# Altium schematic sheet 40-DIGITAL.SchDoc
size 594 x 420 mm
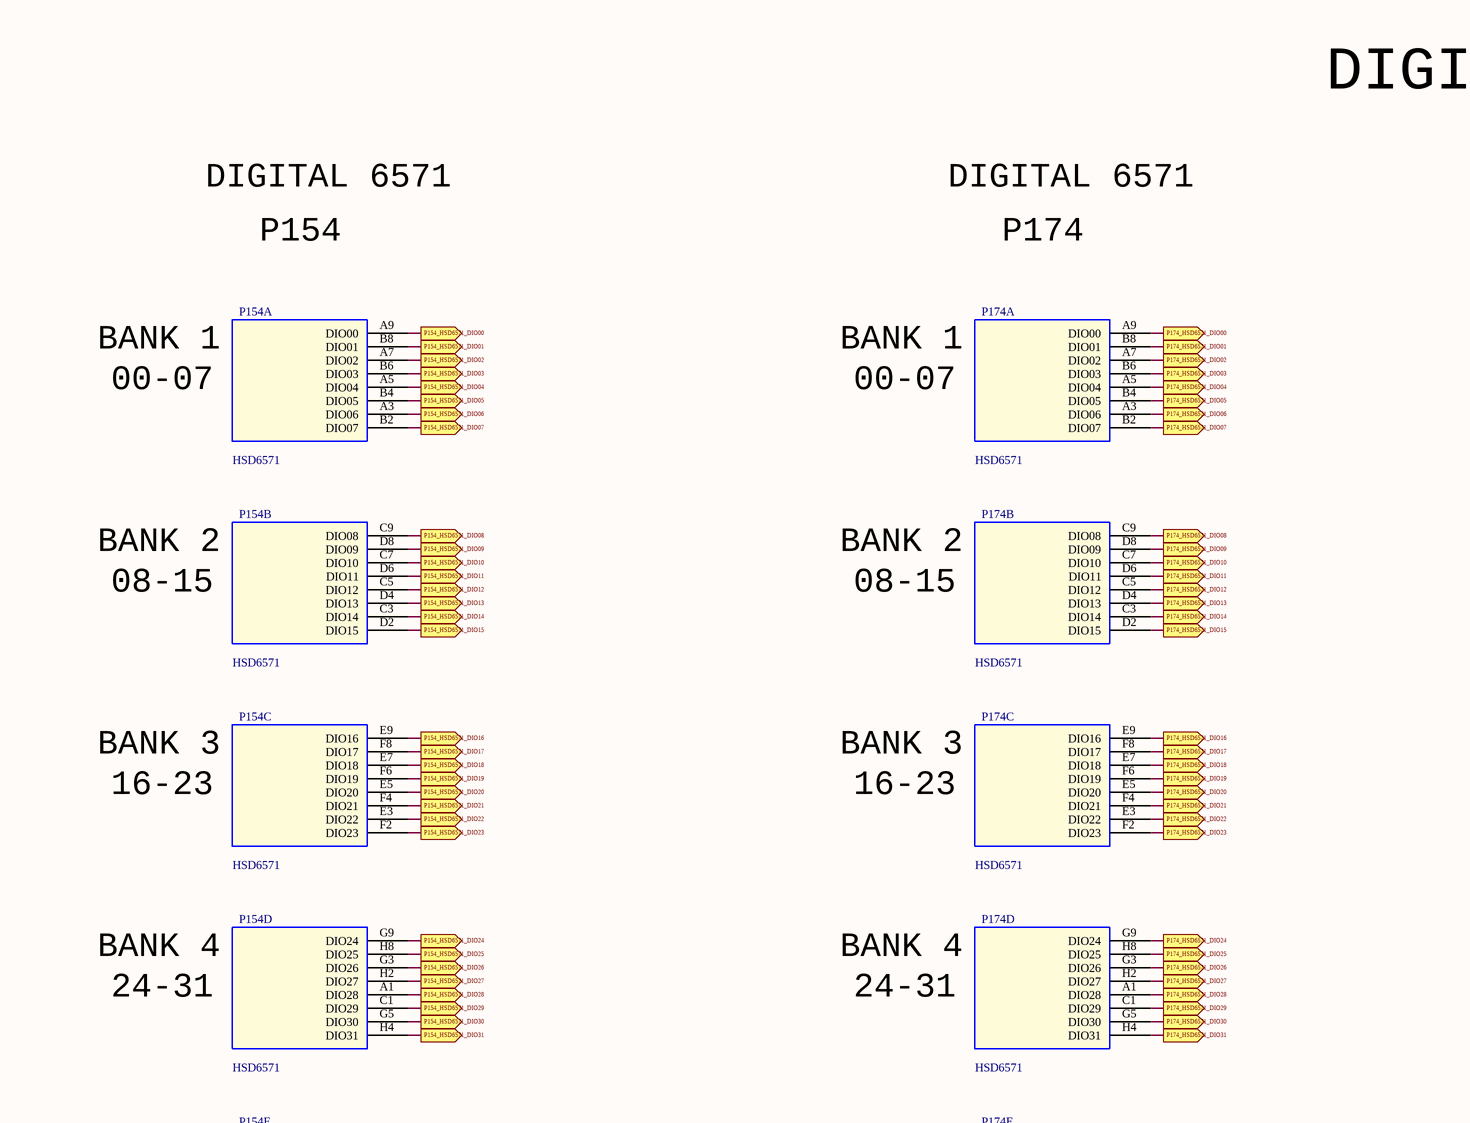
[diagram p0: 40-DIGITAL.SchDoc, top left]
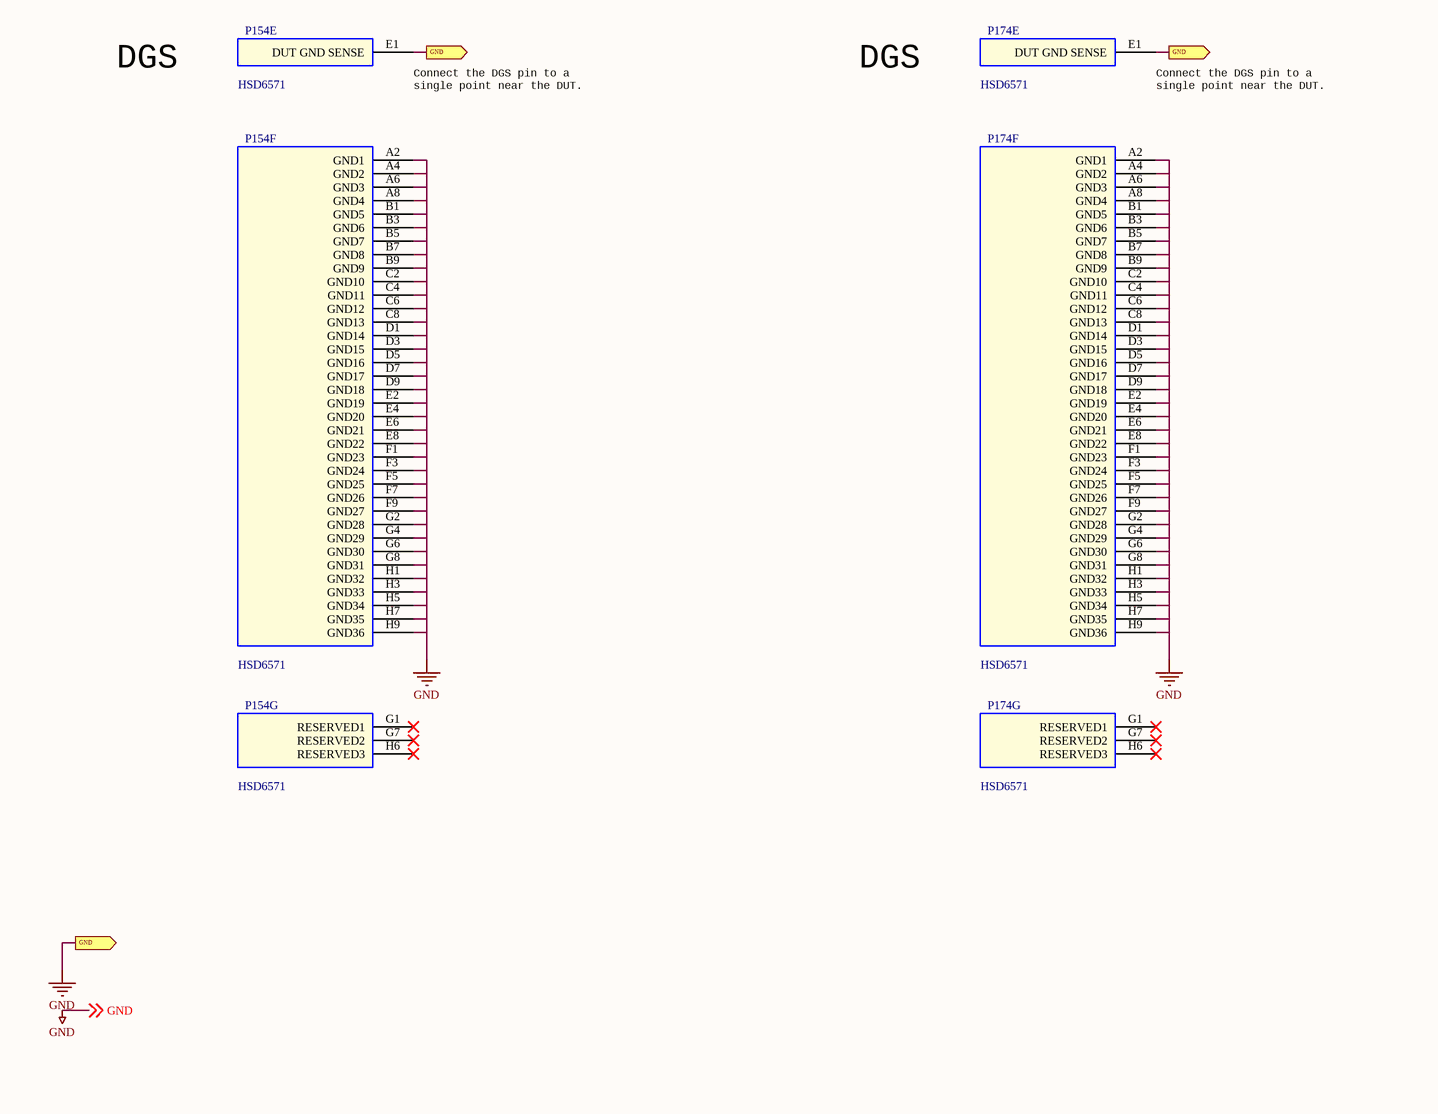
[diagram p1: 40-DIGITAL.SchDoc, bottom left]
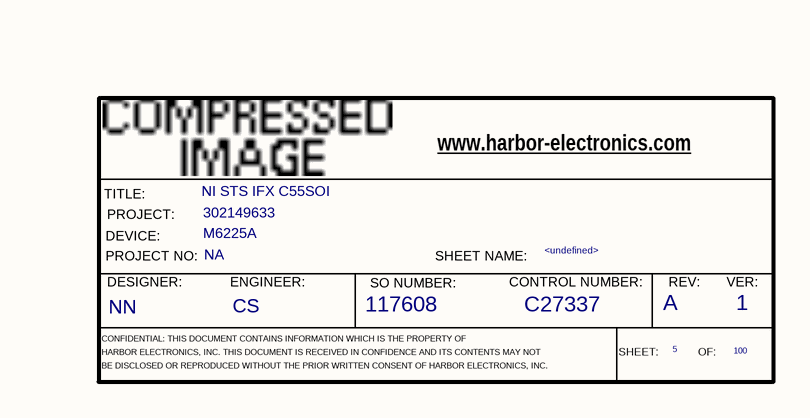
[diagram p2: 40-DIGITAL.SchDoc, bottom right]

## Parts
*  RevCode: A  Title: NI STS IFX C55SOI  Page Number: 5  Page Count: 100  Engineer: CS  Designer: NN  SO Number: 117608  Control Number: C27337  Version: 1  Page Name: <undefined>  PROJECT: 302149633  DEVICE: M6225A  PROJECT NO.: NA  (hidden comment: HE_DEFAULT)  (graphical)
P154  HSD6571  [285092A-08_72PIN]  (parts A,B,C,D,E,F,G of 7)
P174  HSD6571  [285092A-08_72PIN]  (parts A,B,C,D,E,F,G of 7)

## Ports
GND (out), P154_HSD6571_DIO00 (out), P154_HSD6571_DIO01 (out), P154_HSD6571_DIO02 (out), P154_HSD6571_DIO03 (out), P154_HSD6571_DIO04 (out), P154_HSD6571_DIO05 (out), P154_HSD6571_DIO06 (out), P154_HSD6571_DIO07 (out), P154_HSD6571_DIO08 (out), P154_HSD6571_DIO09 (out), P154_HSD6571_DIO10 (out), P154_HSD6571_DIO11 (out), P154_HSD6571_DIO12 (out), P154_HSD6571_DIO13 (out), P154_HSD6571_DIO14 (out), P154_HSD6571_DIO15 (out), P154_HSD6571_DIO16 (out), P154_HSD6571_DIO17 (out), P154_HSD6571_DIO18 (out), P154_HSD6571_DIO19 (out), P154_HSD6571_DIO20 (out), P154_HSD6571_DIO21 (out), P154_HSD6571_DIO22 (out), P154_HSD6571_DIO23 (out), P154_HSD6571_DIO24 (out), P154_HSD6571_DIO25 (out), P154_HSD6571_DIO26 (out), P154_HSD6571_DIO27 (out), P154_HSD6571_DIO28 (out), P154_HSD6571_DIO29 (out), P154_HSD6571_DIO30 (out), P154_HSD6571_DIO31 (out), P174_HSD6571_DIO00 (out), P174_HSD6571_DIO01 (out), P174_HSD6571_DIO02 (out), P174_HSD6571_DIO03 (out), P174_HSD6571_DIO04 (out), P174_HSD6571_DIO05 (out), P174_HSD6571_DIO06 (out), P174_HSD6571_DIO07 (out), P174_HSD6571_DIO08 (out), P174_HSD6571_DIO09 (out), P174_HSD6571_DIO10 (out), P174_HSD6571_DIO11 (out), P174_HSD6571_DIO12 (out), P174_HSD6571_DIO13 (out), P174_HSD6571_DIO14 (out), P174_HSD6571_DIO15 (out), P174_HSD6571_DIO16 (out), P174_HSD6571_DIO17 (out), P174_HSD6571_DIO18 (out), P174_HSD6571_DIO19 (out), P174_HSD6571_DIO20 (out), P174_HSD6571_DIO21 (out), P174_HSD6571_DIO22 (out), P174_HSD6571_DIO23 (out), P174_HSD6571_DIO24 (out), P174_HSD6571_DIO25 (out), P174_HSD6571_DIO26 (out), P174_HSD6571_DIO27 (out), P174_HSD6571_DIO28 (out), P174_HSD6571_DIO29 (out), P174_HSD6571_DIO30 (out), P174_HSD6571_DIO31 (out)

## Nets
GND: P154.A2(GND1) P154.A4(GND2) P154.A6(GND3) P154.A8(GND4) P154.B1(GND5) P154.B3(GND6) P154.B5(GND7) P154.B7(GND8) P154.B9(GND9) P154.C2(GND10) P154.C4(GND11) P154.C6(GND12) P154.C8(GND13) P154.D1(GND14) P154.D3(GND15) P154.D5(GND16) P154.D7(GND17) P154.D9(GND18) P154.E1(DUT_GND_SENSE) P154.E2(GND19) P154.E4(GND20) P154.E6(GND21) P154.E8(GND22) P154.F1(GND23) P154.F3(GND24) P154.F5(GND25) P154.F7(GND26) P154.F9(GND27) P154.G2(GND28) P154.G4(GND29) P154.G6(GND30) P154.G8(GND31) P154.H1(GND32) P154.H3(GND33) P154.H5(GND34) P154.H7(GND35) P154.H9(GND36) P174.A2(GND1) P174.A4(GND2) P174.A6(GND3) P174.A8(GND4) P174.B1(GND5) P174.B3(GND6) P174.B5(GND7) P174.B7(GND8) P174.B9(GND9) P174.C2(GND10) P174.C4(GND11) P174.C6(GND12) P174.C8(GND13) P174.D1(GND14) P174.D3(GND15) P174.D5(GND16) P174.D7(GND17) P174.D9(GND18) P174.E1(DUT_GND_SENSE) P174.E2(GND19) P174.E4(GND20) P174.E6(GND21) P174.E8(GND22) P174.F1(GND23) P174.F3(GND24) P174.F5(GND25) P174.F7(GND26) P174.F9(GND27) P174.G2(GND28) P174.G4(GND29) P174.G6(GND30) P174.G8(GND31) P174.H1(GND32) P174.H3(GND33) P174.H5(GND34) P174.H7(GND35) P174.H9(GND36) ; off-sheet GND, port GND
P154_HSD6571_DIO00: P154.A9(DIO00) ; port P154_HSD6571_DIO00
P154_HSD6571_DIO01: P154.B8(DIO01) ; port P154_HSD6571_DIO01
P154_HSD6571_DIO02: P154.A7(DIO02) ; port P154_HSD6571_DIO02
P154_HSD6571_DIO03: P154.B6(DIO03) ; port P154_HSD6571_DIO03
P154_HSD6571_DIO04: P154.A5(DIO04) ; port P154_HSD6571_DIO04
P154_HSD6571_DIO05: P154.B4(DIO05) ; port P154_HSD6571_DIO05
P154_HSD6571_DIO06: P154.A3(DIO06) ; port P154_HSD6571_DIO06
P154_HSD6571_DIO07: P154.B2(DIO07) ; port P154_HSD6571_DIO07
P154_HSD6571_DIO08: P154.C9(DIO08) ; port P154_HSD6571_DIO08
P154_HSD6571_DIO09: P154.D8(DIO09) ; port P154_HSD6571_DIO09
P154_HSD6571_DIO10: P154.C7(DIO10) ; port P154_HSD6571_DIO10
P154_HSD6571_DIO11: P154.D6(DIO11) ; port P154_HSD6571_DIO11
P154_HSD6571_DIO12: P154.C5(DIO12) ; port P154_HSD6571_DIO12
P154_HSD6571_DIO13: P154.D4(DIO13) ; port P154_HSD6571_DIO13
P154_HSD6571_DIO14: P154.C3(DIO14) ; port P154_HSD6571_DIO14
P154_HSD6571_DIO15: P154.D2(DIO15) ; port P154_HSD6571_DIO15
P154_HSD6571_DIO16: P154.E9(DIO16) ; port P154_HSD6571_DIO16
P154_HSD6571_DIO17: P154.F8(DIO17) ; port P154_HSD6571_DIO17
P154_HSD6571_DIO18: P154.E7(DIO18) ; port P154_HSD6571_DIO18
P154_HSD6571_DIO19: P154.F6(DIO19) ; port P154_HSD6571_DIO19
P154_HSD6571_DIO20: P154.E5(DIO20) ; port P154_HSD6571_DIO20
P154_HSD6571_DIO21: P154.F4(DIO21) ; port P154_HSD6571_DIO21
P154_HSD6571_DIO22: P154.E3(DIO22) ; port P154_HSD6571_DIO22
P154_HSD6571_DIO23: P154.F2(DIO23) ; port P154_HSD6571_DIO23
P154_HSD6571_DIO24: P154.G9(DIO24) ; port P154_HSD6571_DIO24
P154_HSD6571_DIO25: P154.H8(DIO25) ; port P154_HSD6571_DIO25
P154_HSD6571_DIO26: P154.G3(DIO26) ; port P154_HSD6571_DIO26
P154_HSD6571_DIO27: P154.H2(DIO27) ; port P154_HSD6571_DIO27
P154_HSD6571_DIO28: P154.A1(DIO28) ; port P154_HSD6571_DIO28
P154_HSD6571_DIO29: P154.C1(DIO29) ; port P154_HSD6571_DIO29
P154_HSD6571_DIO30: P154.G5(DIO30) ; port P154_HSD6571_DIO30
P154_HSD6571_DIO31: P154.H4(DIO31) ; port P154_HSD6571_DIO31
P174_HSD6571_DIO00: P174.A9(DIO00) ; port P174_HSD6571_DIO00
P174_HSD6571_DIO01: P174.B8(DIO01) ; port P174_HSD6571_DIO01
P174_HSD6571_DIO02: P174.A7(DIO02) ; port P174_HSD6571_DIO02
P174_HSD6571_DIO03: P174.B6(DIO03) ; port P174_HSD6571_DIO03
P174_HSD6571_DIO04: P174.A5(DIO04) ; port P174_HSD6571_DIO04
P174_HSD6571_DIO05: P174.B4(DIO05) ; port P174_HSD6571_DIO05
P174_HSD6571_DIO06: P174.A3(DIO06) ; port P174_HSD6571_DIO06
P174_HSD6571_DIO07: P174.B2(DIO07) ; port P174_HSD6571_DIO07
P174_HSD6571_DIO08: P174.C9(DIO08) ; port P174_HSD6571_DIO08
P174_HSD6571_DIO09: P174.D8(DIO09) ; port P174_HSD6571_DIO09
P174_HSD6571_DIO10: P174.C7(DIO10) ; port P174_HSD6571_DIO10
P174_HSD6571_DIO11: P174.D6(DIO11) ; port P174_HSD6571_DIO11
P174_HSD6571_DIO12: P174.C5(DIO12) ; port P174_HSD6571_DIO12
P174_HSD6571_DIO13: P174.D4(DIO13) ; port P174_HSD6571_DIO13
P174_HSD6571_DIO14: P174.C3(DIO14) ; port P174_HSD6571_DIO14
P174_HSD6571_DIO15: P174.D2(DIO15) ; port P174_HSD6571_DIO15
P174_HSD6571_DIO16: P174.E9(DIO16) ; port P174_HSD6571_DIO16
P174_HSD6571_DIO17: P174.F8(DIO17) ; port P174_HSD6571_DIO17
P174_HSD6571_DIO18: P174.E7(DIO18) ; port P174_HSD6571_DIO18
P174_HSD6571_DIO19: P174.F6(DIO19) ; port P174_HSD6571_DIO19
P174_HSD6571_DIO20: P174.E5(DIO20) ; port P174_HSD6571_DIO20
P174_HSD6571_DIO21: P174.F4(DIO21) ; port P174_HSD6571_DIO21
P174_HSD6571_DIO22: P174.E3(DIO22) ; port P174_HSD6571_DIO22
P174_HSD6571_DIO23: P174.F2(DIO23) ; port P174_HSD6571_DIO23
P174_HSD6571_DIO24: P174.G9(DIO24) ; port P174_HSD6571_DIO24
P174_HSD6571_DIO25: P174.H8(DIO25) ; port P174_HSD6571_DIO25
P174_HSD6571_DIO26: P174.G3(DIO26) ; port P174_HSD6571_DIO26
P174_HSD6571_DIO27: P174.H2(DIO27) ; port P174_HSD6571_DIO27
P174_HSD6571_DIO28: P174.A1(DIO28) ; port P174_HSD6571_DIO28
P174_HSD6571_DIO29: P174.C1(DIO29) ; port P174_HSD6571_DIO29
P174_HSD6571_DIO30: P174.G5(DIO30) ; port P174_HSD6571_DIO30
P174_HSD6571_DIO31: P174.H4(DIO31) ; port P174_HSD6571_DIO31

Not connected (* = marked no-connect by the designer): P154 G1(RESERVED1)* G7(RESERVED2)* H6(RESERVED3)*; P174 G1(RESERVED1)* G7(RESERVED2)* H6(RESERVED3)*

## Notes on the sheet
- DIGITAL
- DIGITAL 6571
- P154
- P174
- BANK 1
- 00-07
- BANK 2
- 08-15
- BANK 3
- 16-23
- BANK 4
- 24-31
- DGS
- (near P154) Connect the DGS pin to a
  single point near the DUT.
- (near P174) Connect the DGS pin to a
  single point near the DUT.
- (in symbol HE_DEFAULT) www.harbor-electronics.com; TITLE:; PROJECT:; DEVICE:; PROJECT NO:; SHEET NAME:; DESIGNER:; ENGINEER:; SO NUMBER:; CONTROL NUMBER:; REV:; VER:; CONFIDENTIAL: THIS DOCUMENT CONTAINS INFORMATION WHICH IS THE PROPERTY OF; HARBOR ELECTRONICS, INC. THIS DOCUMENT IS RECEIVED IN CONFIDENCE AND ITS CONTENTS MAY NOT; SHEET:; OF:; BE DISCLOSED OR REPRODUCED WITHOUT THE PRIOR WRITTEN CONSENT OF HARBOR ELECTRONICS, INC.

## Library data of the parts
* = HE_DEFAULT: Page Size: X; OrgAddr4: Fax: +1 602-431-9633; OrgAddr1: 4050 E. Cotton Center Blvd., Suite 33; OrgAddr2: Phoenix, Arizona 85040 U.S.A.; OrgAddr3: Phone: +1 602-438-1112; Doc: <Title Name>; OrgName: HARBOR
P154 P174 = HSD6571: SPLIT_INST: TRUE; SWAP_INFO: (S1+S2+S3+S4+S5+S6+S7); PCB Footprint: 285092A-08_72PIN